# EAGLE design EagleCAD tutorial (EAGLE 9.6.2)
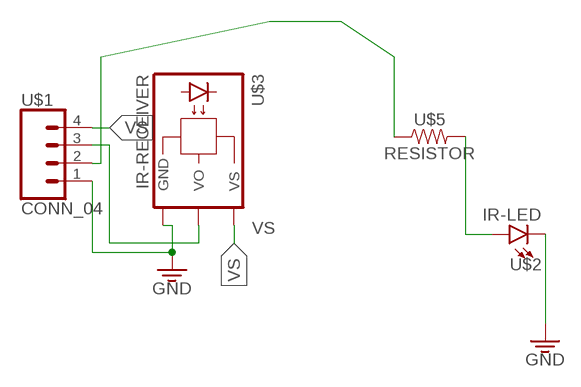
[diagram p0: schematic, sheet 1]

## Parts
U$1  CONN_04  [MOLEX-1X4]
U$2  IR-LED  [LED_5MM]
U$3  IR-RECEIVER  [TSOP17_TB1]
U$5  RESISTOR  [AXIAL-0.3]

## Nets
3.3V: U$1.1 U$2.K(C) U$3.GND ; supply symbol labelled GND
N$1: U$2.A U$5.P$2
N$2: U$1.3 U$3.VO
N$3: U$1.2 U$5.P$1
VS: U$1.4 U$3.VS

## Library data of the parts
U$1 = ECE5_Tutorial:CONN_04
U$2 = ECE5_Tutorial:IR-LED
U$3 = ECE5_Tutorial:IR-RECEIVER
U$5 = ECE5_Tutorial:RESISTOR

## Board
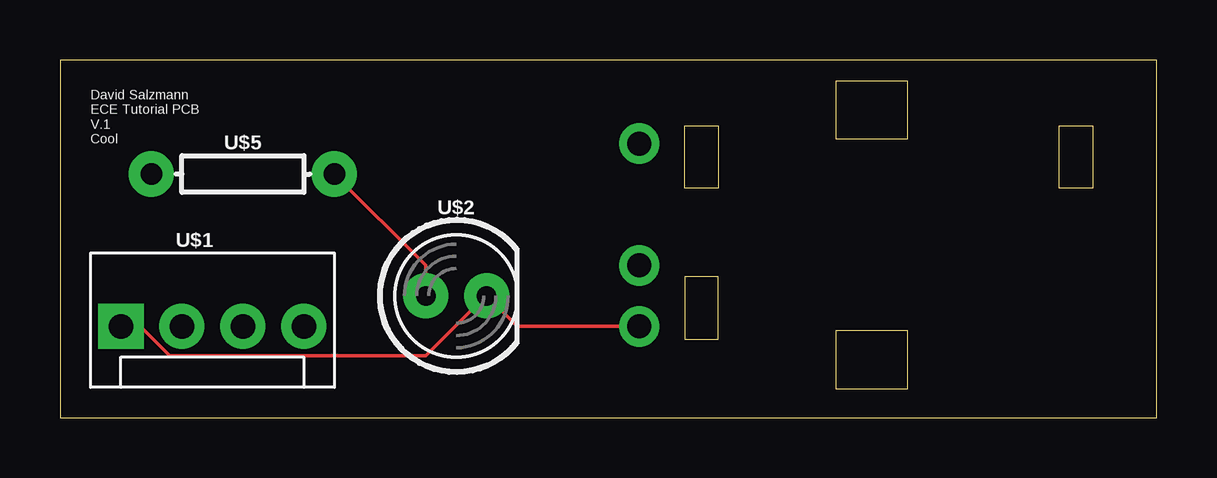
[diagram p1: board, top side]
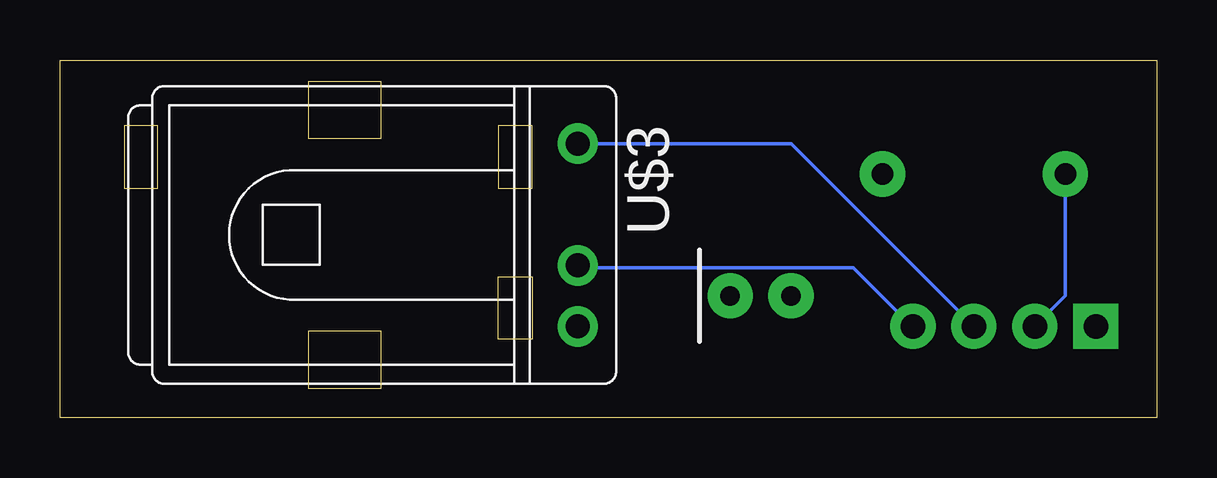
[diagram p2: board, bottom side, seen from below]

Size 45.7 x 14.91 mm. Coordinates in mm from the lower left corner, seen from the top.
Outline: 0,0 45.7,0 45.7,14.91 0,14.91 0,0
Copper layers (1*16): Top 0.035mm / dielectric 1.5mm / Bottom 0.035mm
Design rules "default": minimum track width 6mil, minimum drill 0.35mm, track to track 6mil, track to pad 6mil, pad to pad 6mil, via to via 6mil, smd to smd 6mil, copper to edge 40mil, drill to drill 6mil, minimum pad ring 10mil, minimum via ring 8mil, stop-mask expansion 4mil, vias tented up to drill 0mil, thermal gap 10mil

### Footprints (pad centres in the part's own frame; a part is rotated, then mirrored left to right if it is on the bottom)
MOLEX-1X4 = drill 1.016 pad 1.88 square: 1 0,0 | drill 1.016 pad 1.88: 2 2.54,0; 3 5.08,0; 4 7.62,0
LED_5MM = drill 0.813 pad 1.88: A -1.27,0; K 1.27,0
TSOP17_TB1 = drill 1 pad 1.676: GND 0,-3.81; VO 0,3.81; VS 0,-1.27
AXIAL-0.3 = drill 0.9 pad 1.88: P$1 -3.81,0; P$2 3.81,0

### Placement (x,y rotation side)
U$1  2.54,3.81 0 top
U$2  16.51,5.08 0 top
U$3  24.13,7.62 0 bottom
U$5  7.62,10.16 0 top

### Tracks (layer width: path | path; a pad name or v marks a point on that pad's centre or on a via)
3.3V
  Top 0.152: U$3.GND 19.05,3.81 U$2.K 17.68,5.03 15.24,2.59 4.57,2.59 3.35,3.81 U$1.1
N$1
  Top 0.152: U$5.P$2 15.24,6.35 U$2.A
N$2
  Bottom 0.152: U$3.VO 15.24,11.43 U$1.3
N$3
  Bottom 0.152: U$1.2 3.81,5.08 U$5.P$1
VS
  Bottom 0.152: U$3.VS 24.08,6.25 12.65,6.25 10.21,3.81 U$1.4

### Text on the board
tPlace: David Salzmann / ECE Tutorial PCB / V.1 / Cool